# EAGLE design MultiWiiChassis_hexlite_power (EAGLE 6.4)
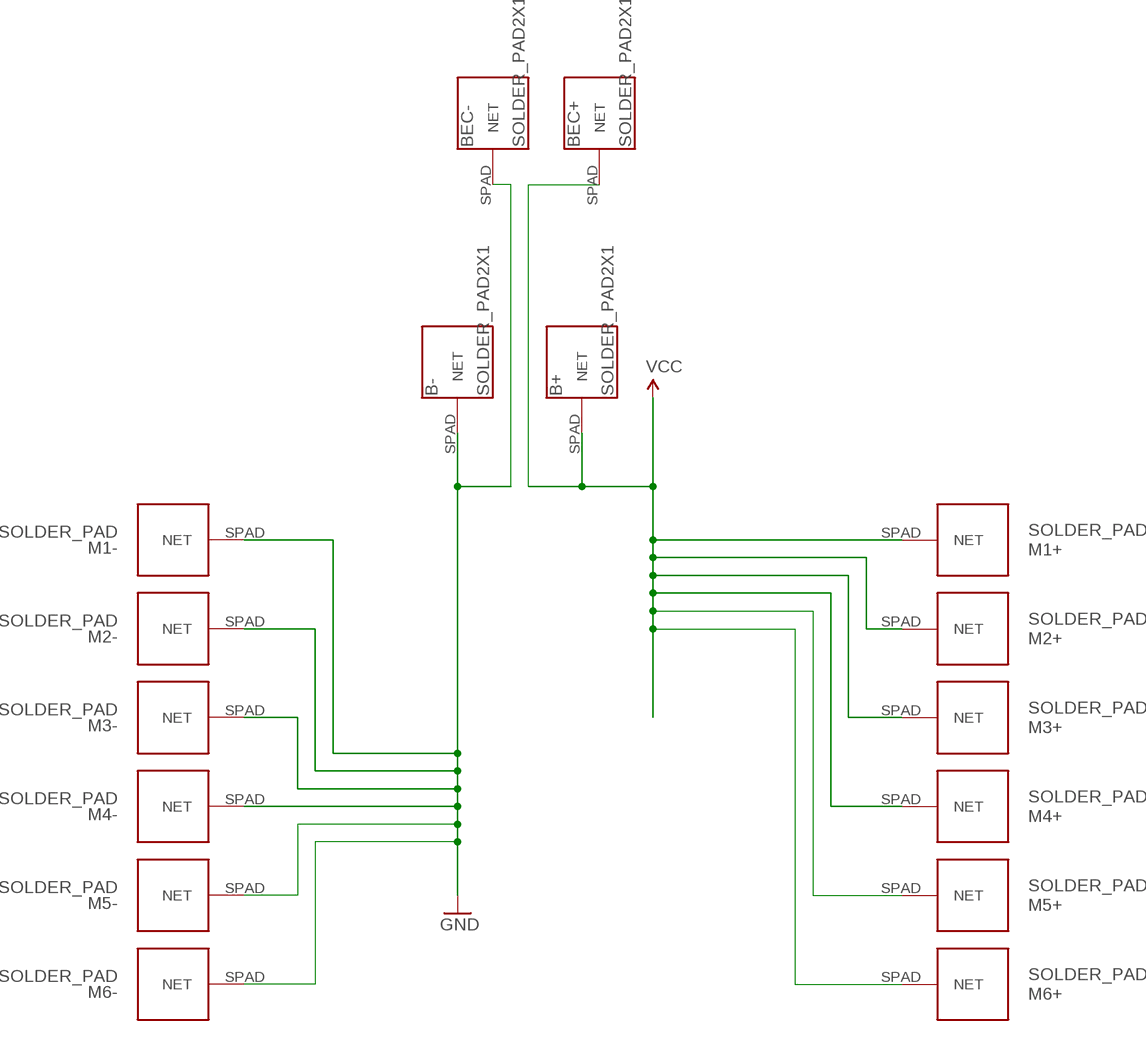
[diagram p0: schematic, sheet 1]

## Parts
B+  SOLDER_PAD2X1  [SOLDER_PAD_2X1]
B-  SOLDER_PAD2X1  [SOLDER_PAD_2X1]
BEC+  SOLDER_PAD2X1  [SOLDER_PAD_2X1]
BEC-  SOLDER_PAD2X1  [SOLDER_PAD_2X1]
M1+  SOLDER_PAD  [SOLDER_PAD]
M1-  SOLDER_PAD  [SOLDER_PAD]
M2+  SOLDER_PAD  [SOLDER_PAD]
M2-  SOLDER_PAD  [SOLDER_PAD]
M3+  SOLDER_PAD  [SOLDER_PAD]
M3-  SOLDER_PAD  [SOLDER_PAD]
M4+  SOLDER_PAD  [SOLDER_PAD]
M4-  SOLDER_PAD  [SOLDER_PAD]
M5+  SOLDER_PAD  [SOLDER_PAD]
M5-  SOLDER_PAD  [SOLDER_PAD]
M6+  SOLDER_PAD  [SOLDER_PAD]
M6-  SOLDER_PAD  [SOLDER_PAD]

## Nets
GND: B-.SPAD(NET) BEC-.SPAD(NET) M1-.SPAD(NET) M2-.SPAD(NET) M3-.SPAD(NET) M4-.SPAD(NET) M5-.SPAD(NET) M6-.SPAD(NET)
VCC: B+.SPAD(NET) BEC+.SPAD(NET) M1+.SPAD(NET) M2+.SPAD(NET) M3+.SPAD(NET) M4+.SPAD(NET) M5+.SPAD(NET) M6+.SPAD(NET)

## Library data of the parts
B+ B- BEC+ BEC- M1+ M1- M2+ M2- M3+ M3- M4+ M4- M5+ M5- M6+ M6- = JCM:SOLDER_PAD

## Board
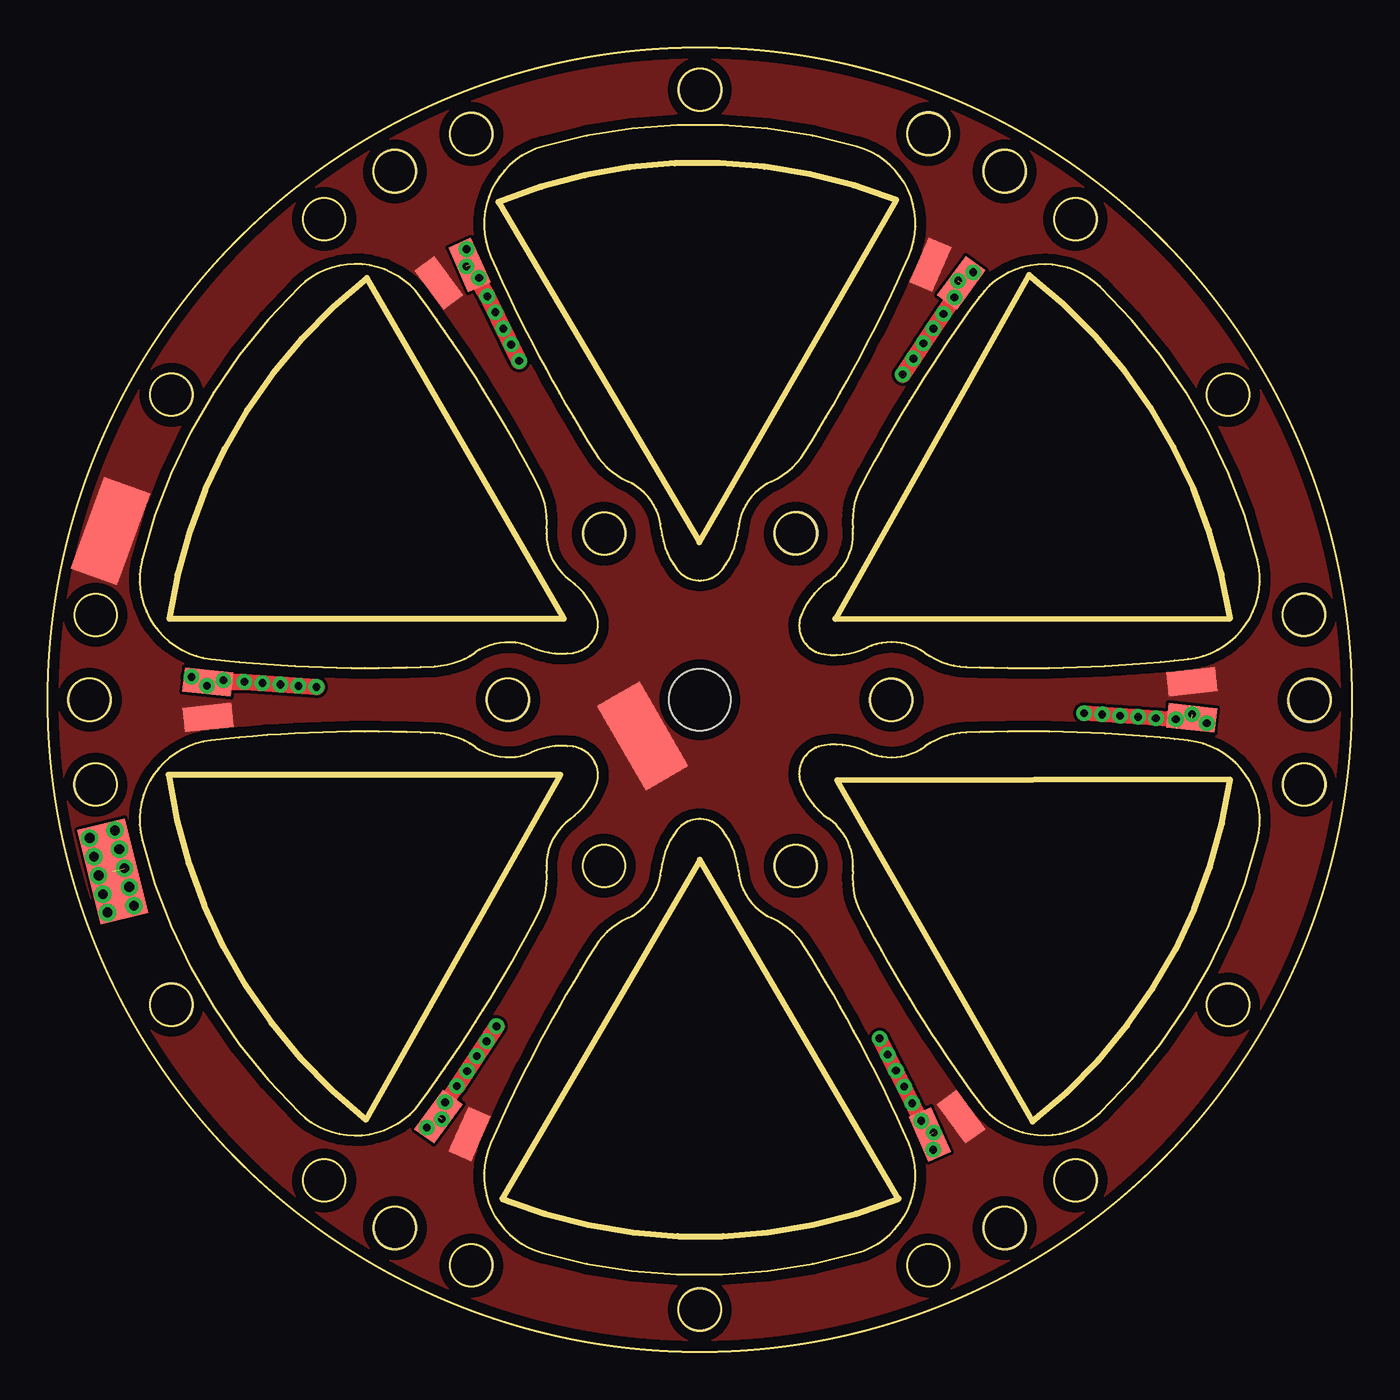
[diagram p1: board, top side]
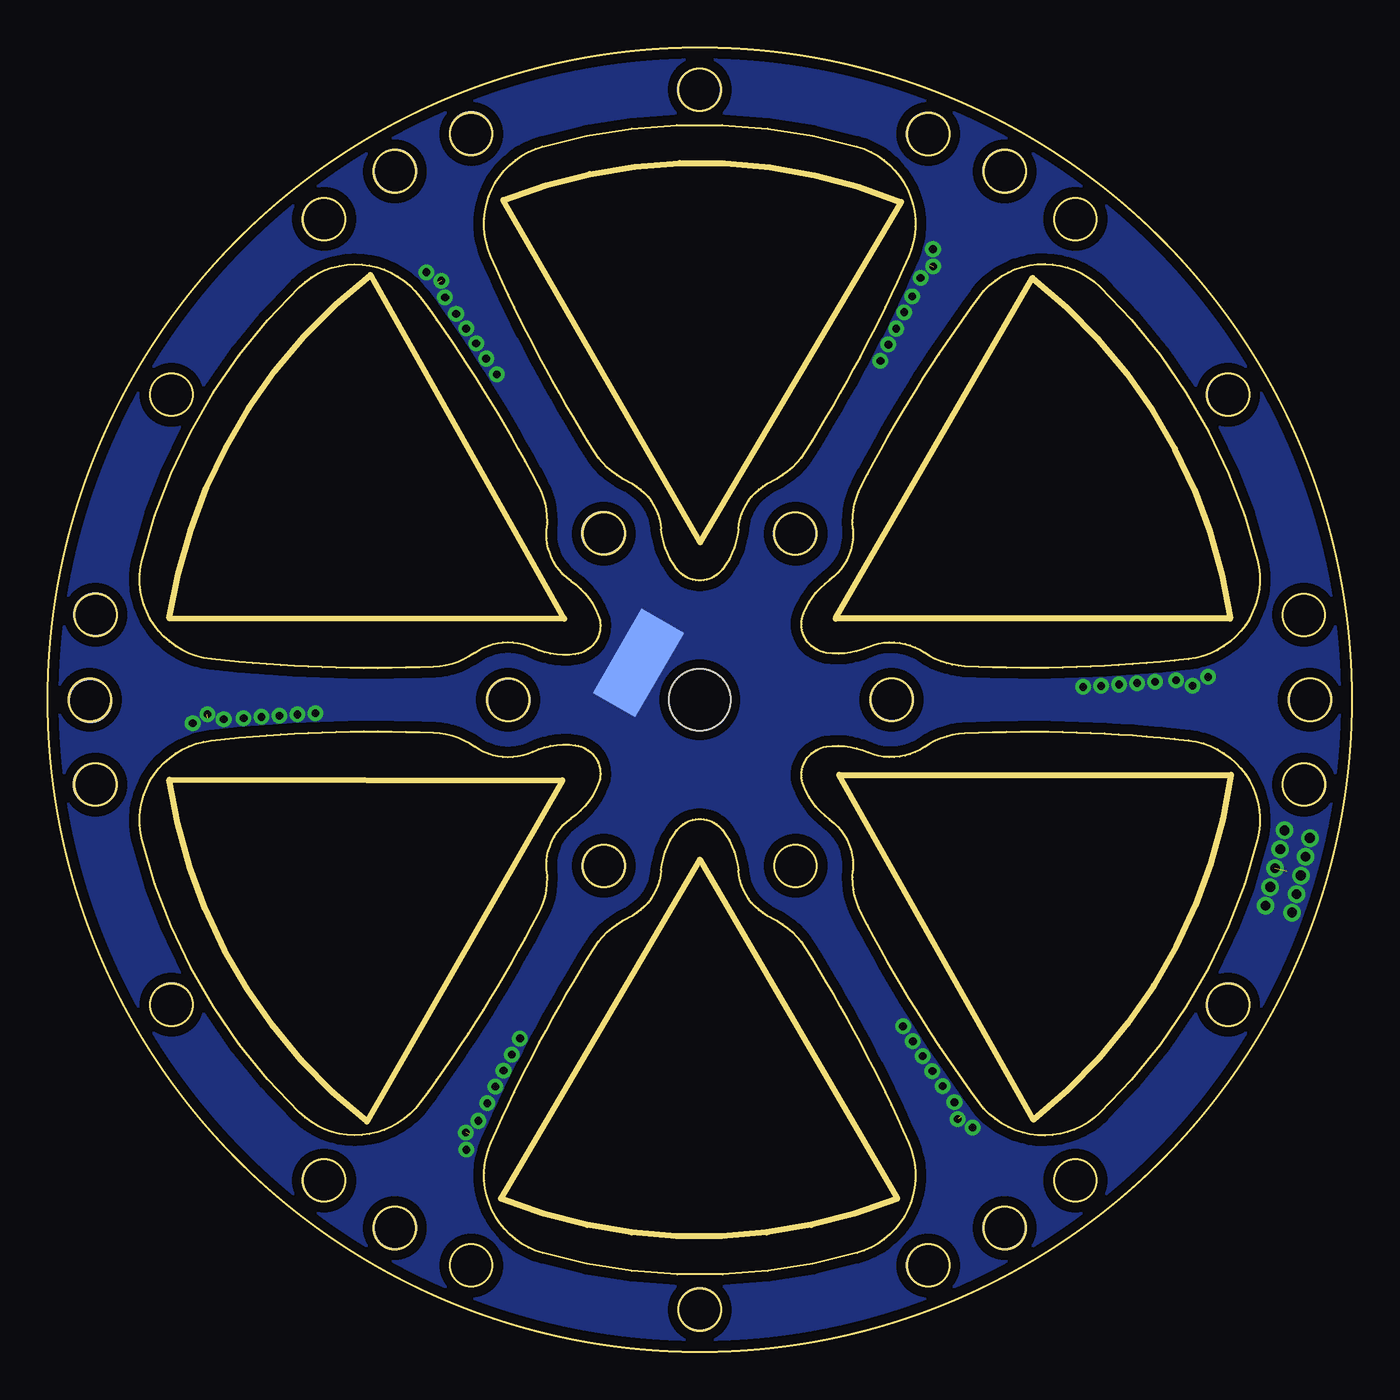
[diagram p2: board, bottom side, seen from below]

Size 68 x 68 mm. Coordinates in mm from the lower left corner, seen from the top.
Outline: 27.41,31.55 arc-103 28.59,29.52 arc-32 27.23,27.76 arc59 26.01,25.07 arc-32 25.58,22.89 25.25,22.24 24.9,21.6 24.55,20.96 24.2,20.32 23.84,19.69 23.47,19.06 23.09,18.43 22.71,17.81 22.32,17.2 21.92,16.58 21.52,15.97 21.11,15.36 20.7,14.76 20.28,14.16 19.85,13.57 19.42,12.98 arc-98 13.12,12.46 arc-32 4.91,26.68 arc-98 8.51,31.88 9.24,31.96 9.97,32.03 10.7,32.09 11.43,32.15 12.16,32.2 12.89,32.24 13.62,32.28 14.35,32.3 15.08,32.32 15.81,32.34 16.54,32.34 17.27,32.34 18,32.33 18.72,32.31 19.45,32.29 20.18,32.26 arc-32 22.28,31.54 arc59 25.21,31.26 arc-32 27.41,31.55 27.41,31.55
Outline: 27.41,31.55 27.41,31.55
Outline: 27.41,31.55 27.41,31.55
Outline: 27.41,31.55 27.41,31.55
Outline: 27.41,31.55 27.41,31.55
Outline: 27.41,31.55 27.41,31.55
Outline: 27.41,31.55 27.41,31.55
Outline: 27.41,31.55 27.41,31.55
Outline: 27.41,31.55 27.41,31.55
Outline: 27.41,31.55 27.41,31.55
Outline: 27.41,31.55 27.41,31.55
Outline: 27.41,31.55 27.41,31.55
Outline: 27.41,31.55 27.41,31.55
Outline: 27.41,31.55 27.41,31.55
Outline: 27.41,31.55 27.41,31.55
Outline: 27.4,36.45 27.4,36.45
Outline: 27.4,36.45 27.4,36.45 27.4,36.45
Outline: 27.4,36.45 27.4,36.45
Outline: 27.4,36.45 27.41,36.45 27.41,36.45
Outline: 27.41,36.45 27.41,36.45
Outline: 27.41,36.45 27.41,36.45
Outline: 27.41,36.45 27.41,36.45
Outline: 27.41,36.45 27.41,36.45
Outline: 27.41,36.45 27.41,36.45
Outline: 27.41,36.45 27.41,36.45
Outline: 27.41,36.45 27.41,36.45
Outline: 27.41,36.45 27.41,36.45
Outline: 27.41,36.45 27.41,36.45 arc103 28.59,38.48 arc32 27.23,40.24 arc-59 26.01,42.93 arc32 25.58,45.11 25.25,45.76 24.9,46.4 24.55,47.04 24.2,47.68 23.84,48.31 23.47,48.94 23.09,49.56 22.71,50.19 22.32,50.8 21.93,51.42 21.52,52.03 21.12,52.63 20.7,53.24 20.28,53.84 19.86,54.43 19.42,55.02 arc98 13.12,55.54 arc32 4.91,41.32 arc98 8.51,36.12 9.24,36.04 9.97,35.97 10.7,35.91 11.43,35.85 12.16,35.8 12.89,35.76 13.62,35.73 14.35,35.7 15.08,35.68 15.81,35.67 16.54,35.66 17.27,35.66 18,35.67 18.73,35.69 19.46,35.71 20.19,35.75 arc32 22.28,36.46 arc-59 25.21,36.75 arc32 27.4,36.45
Outline: 28.54,21.12 28.16,20.5 27.78,19.88 27.41,19.26 27.04,18.64 26.68,18.01 26.32,17.38 25.97,16.74 25.63,16.1 25.29,15.46 24.96,14.82 24.64,14.16 24.32,13.51 24,12.86 23.7,12.2 23.39,11.53 23.1,10.87 arc98 25.8,5.14 arc32 42.2,5.14 arc98 44.9,10.86 44.6,11.53 44.3,12.19 43.99,12.85 43.68,13.51 43.36,14.16 43.04,14.81 42.71,15.46 42.37,16.1 42.03,16.74 41.68,17.38 41.32,18.01 40.96,18.64 40.6,19.26 40.22,19.88 39.84,20.5 39.46,21.12 arc33 37.75,22.61 arc-60 36.01,25.09 arc33 35.19,27.2 arc104 32.81,27.2 arc33 31.99,25.09 arc-60 30.25,22.61 arc33 28.54,21.12
Outline: 42.43,22.83 42.77,22.19 43.11,21.55 43.47,20.92 43.82,20.29 44.19,19.66 44.56,19.04 44.93,18.42 45.31,17.8 45.7,17.19 46.1,16.58 46.49,15.97 46.9,15.37 47.31,14.77 47.73,14.18 48.15,13.58 48.58,12.99 arc98 54.89,12.47 arc32 63.09,26.67 arc98 59.48,31.87 58.76,31.95 58.03,32.02 57.31,32.08 56.59,32.14 55.86,32.19 55.14,32.23 54.41,32.27 53.69,32.3 52.96,32.32 52.24,32.34 51.51,32.35 50.79,32.35 50.06,32.34 49.34,32.33 48.61,32.31 47.89,32.29 arc33 45.73,31.55 arc-60 42.72,31.28 arc33 40.48,31.63 arc104 39.3,29.58 arc33 40.71,27.8 arc-60 41.99,25.06 arc33 42.43,22.83
Outline: 47.89,35.71 48.61,35.69 49.34,35.67 50.06,35.66 50.78,35.65 51.51,35.65 52.23,35.66 52.96,35.68 53.69,35.7 54.41,35.73 55.13,35.77 55.86,35.81 56.58,35.86 57.31,35.91 58.03,35.98 58.76,36.05 59.48,36.13 arc98 63.09,41.33 arc32 54.89,55.53 arc98 48.59,55.01 48.16,54.42 47.73,53.83 47.31,53.23 46.9,52.63 46.5,52.03 46.1,51.42 45.7,50.81 45.32,50.2 44.93,49.58 44.56,48.96 44.19,48.34 43.82,47.71 43.47,47.08 43.11,46.45 42.77,45.81 42.43,45.17 arc33 41.99,42.94 arc-60 40.71,40.2 arc33 39.3,38.42 arc104 40.48,36.37 arc33 42.73,36.72 arc-60 45.73,36.45 arc33 47.89,35.71
Outline: 39.46,46.88 39.84,47.5 40.22,48.12 40.59,48.74 40.96,49.36 41.32,49.99 41.68,50.62 42.03,51.26 42.37,51.9 42.71,52.54 43.04,53.19 43.36,53.84 43.68,54.49 44,55.14 44.3,55.8 44.6,56.47 44.9,57.13 arc98 42.2,62.86 arc32 25.8,62.86 arc98 23.1,57.14 23.4,56.47 23.7,55.81 24,55.15 24.32,54.49 24.64,53.84 24.96,53.19 25.29,52.54 25.63,51.9 25.97,51.26 26.32,50.62 26.68,49.99 27.04,49.36 27.4,48.74 27.78,48.12 28.16,47.5 28.54,46.88 arc33 30.25,45.39 arc-60 31.99,42.91 arc33 32.81,40.8 arc104 35.19,40.8 arc33 36.01,42.91 arc-60 37.75,45.39 arc33 39.46,46.88
Outline: circle at 29,25.34 radius 1.1
Outline: circle at 39,25.34 radius 1.1
Outline: circle at 44,34 radius 1.1
Outline: circle at 39,42.66 radius 1.1
Outline: circle at 29,42.66 radius 1.1
Outline: circle at 24,34 radius 1.1
Outline: circle at 2.49,38.43 radius 1.1
Outline: circle at 14.41,8.93 radius 1.1
Outline: circle at 45.92,4.5 radius 1.1
Outline: circle at 65.51,29.57 radius 1.1
Outline: circle at 53.59,59.07 radius 1.1
Outline: circle at 2.49,29.57 radius 1.1
Outline: circle at 22.08,4.5 radius 1.1
Outline: circle at 53.59,8.93 radius 1.1
Outline: circle at 65.51,38.43 radius 1.1
Outline: circle at 45.92,63.5 radius 1.1
Outline: circle at 22.08,63.5 radius 1.1
Outline: circle at 14.41,59.07 radius 1.1
Outline: circle at 6.44,49.91 radius 1.1
Outline: circle at 6.44,18.09 radius 1.1
Copper layers (1*16): Top 0.0178mm / dielectric 59mil / Bottom 0.0178mm
Design rules "SSC-EAGLE-2Lyr_v1.0.0.3-JCM": minimum track width 6mil, minimum drill 12mil, track to track 6mil, track to pad 6mil, pad to pad 6mil, via to via 6mil, smd to smd 6mil, copper to edge 20mil, drill to drill 16mil, minimum pad ring 8mil, minimum via ring 8mil, stop-mask expansion 3mil, vias tented up to drill 0mil, thermal gap 10mil
Holes 2.2 mm at 29.02,25.32 29.03,42.66 39.03,42.7 43.98,33.99 39.01,25.34 23.98,34.02 18.1,61.58 49.9,61.58 65.8,33.95 49.9,6.45 18.1,6.45 2.15,34 2.5,38.42 2.48,29.58 6.44,49.92 14.41,59.07 22.09,63.51 45.94,63.54 34.02,65.82 53.61,59.07 61.56,49.92 65.52,38.44 65.55,29.58 61.56,18.1 53.61,8.93 45.94,4.51 34,2.2 22.09,4.51 14.41,8.93 6.44,18.1
Holes 3.2 mm at 34,34
vRestrict: 3 lines
Milling: area 23.7,6 to 44.4,25.6; area 41.1,38.2 to 61.7,56.2; area 6.3,12.1 to 26.7,30.1; area 23.5,42.2 to 44.3,62; area 6.3,38.2 to 26.9,56; area 41.2,12 to 61.7,29.8

### Footprints (pad centres in the part's own frame; a part is rotated, then mirrored left to right if it is on the bottom)
SOLDER_PAD_2X1 = smd 5.08 x 2.54: SPAD 0,0
SOLDER_PAD = smd 2.54 x 1.27: SPAD 0,0

### Placement (x,y rotation side)
B+  31.02,32.11 120 top
B-  37.2,35.92 240 bottom
BEC+  3.26,42.8 250 top
BEC-  3.38,25.05 104 top
M1+  20.4,55.74 126.5 top
M1-  21.99,56.68 114 top
M2+  8.36,33.08 186 top
M2-  8.34,34.93 174 top
M3+  59.67,34.94 6.3 top
M3-  59.66,33.06 353.7 top
M4+  46.04,56.7 66.5 top
M4-  47.64,55.75 54 top
M5+  22,11.35 246.3 top
M5-  20.38,12.25 233.7 top
M6+  47.62,12.25 306.3 top
M6-  46,11.32 293.7 top

### Tracks (layer width: path | path; a pad name or v marks a point on that pad's centre or on a via)
GND  (via drill 0.41, 0.51)  (6 unrouted)
  Top 0.813: v54.05,33.3 v57.8,33.04 v58.83,32.98 | v43.38,16.33 v45.09,12.95 v45.55,12.03 | v21.33,13.84 v20.72,13.01
  Top 0.864: v24.58,51.67 v22.92,55.03 22.36,56.02 | v44.59,50.97 v46.71,54.13 v47.29,54.98 | v23.4,16.97 v21.33,13.84 | M2-.SPAD 10.22,34.94 v14.01,34.67
  other vias: 2.18,26.79 3.5,27.19 3.72,26.21 2.65,24.83 2.4,25.81 3.99,25.21 4.24,24.24 3.11,22.91 4.49,23.26 2.87,23.86 7.48,35.19 9.16,35.01 10.25,34.94 11.19,34.87 12.13,34.79 13.07,34.72 8.29,34.73 21.84,57.5 22.49,56.01 23.33,54.21 21.82,56.6 23.75,53.36 24.16,52.53 48.26,56.3 46.19,53.36 45.66,52.59 45.14,51.79 47.47,55.86 60.45,32.77 56.86,33.1 55.92,33.17 54.98,33.24 59.68,33.24 46.17,10.53 44.66,13.82 44.23,14.65 43.8,15.49 46.2,11.43 19.77,11.68 21.87,14.63 22.38,15.41 22.89,16.19 20.55,12.13
  pour Bottom (isolate 0.406, no thermals): -4.66,72.25 70.03,72.62 69.83,-3.62 -4.76,-4.05
VCC
  pour Top (rank 2, no thermals): 70.12,72.2 70.03,-4.1 -5.37,-4.2 -5.27,72.1

### Text on the board
tDocu: J Moreland | + | MultiWiiChassis | HEXPower v2 | Engineering / LLC | -